# Altium project Itampos_Matuoklis.PrjPcb
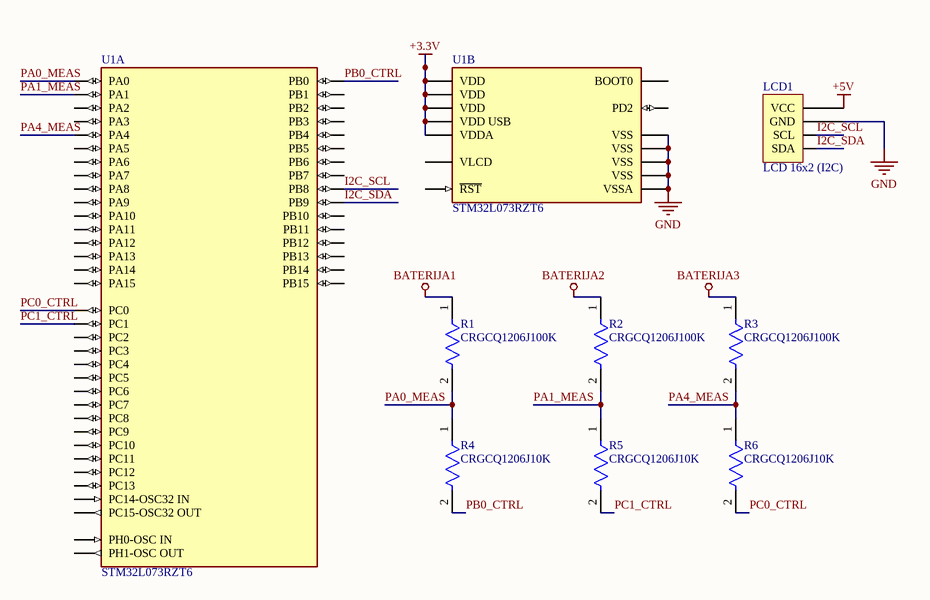
[diagram p0: schema.SchDoc]
1 sheet, 8 parts. Net scope: global (net labels, ports and power ports of the same name join across sheets).

## Sheet schema.SchDoc
size A; SheetNumber: 1; SheetTotal: 1

### Parts
LCD1  LCD 16x2 (I2C)
R1  CRGCQ1206J100K  [FP-CRGCQ1206-IPC_C]
R2  CRGCQ1206J100K  [FP-CRGCQ1206-IPC_C]
R3  CRGCQ1206J100K  [FP-CRGCQ1206-IPC_C]
R4  CRGCQ1206J10K  [FP-CRGCQ1206-IPC_C]
R5  CRGCQ1206J10K  [FP-CRGCQ1206-IPC_C]
R6  CRGCQ1206J10K  [FP-CRGCQ1206-IPC_C]
U1  STM32L073RZT6  [FP-LQFP64-5W-MFG]  (parts A,B of 2)

### Nets
+3.3V: U1.13(VDDA) U1.19(VDD) U1.32(VDD) U1.48(VDD_USB) U1.64(VDD)
+5V: LCD1.1(VCC)
BATERIJA1: R1.1
BATERIJA2: R2.1
BATERIJA3: R3.1
GND: LCD1.2(GND) U1.12(VSSA) U1.18(VSS) U1.31(VSS) U1.47(VSS) U1.63(VSS)
I2C_SCL: LCD1.3(SCL) U1.61(PB8)
I2C_SDA: LCD1.4(SDA) U1.62(PB9)
PA0_MEAS: R1.2 R4.1 U1.14(PA0)
PA1_MEAS: R2.2 R5.1 U1.15(PA1)
PA4_MEAS: R3.2 R6.1 U1.20(PA4)
PB0_CTRL: R4.2 U1.26(PB0)
PC0_CTRL: R6.2 U1.8(PC0)
PC1_CTRL: R5.2 U1.9(PC1)

Not connected (* = marked no-connect by the designer): U1 1(VLCD) 2(PC13) 3(PC14-OSC32_IN) 4(PC15-OSC32_OUT) 5(PH0-OSC_IN) 6(PH1-OSC_OUT) 7(~{RST}) 10(PC2) 11(PC3) 16(PA2) 17(PA3) 21(PA5) 22(PA6) 23(PA7) 24(PC4) 25(PC5) 27(PB1) 28(PB2) 29(PB10) 30(PB11) 33(PB12) 34(PB13) 35(PB14) 36(PB15) 37(PC6) 38(PC7) 39(PC8) 40(PC9) 41(PA8) 42(PA9) 43(PA10) 44(PA11) 45(PA12) 46(PA13) 49(PA14) 50(PA15) 51(PC10) 52(PC11) 53(PC12) 54(PD2) 55(PB3) 56(PB4) 57(PB5) 58(PB6) 59(PB7) 60(BOOT0)

### Library data of the parts
LCD1 = LCD_I2C
R1-R3 = CMP-03211-009069-1: CRGCQ1206 100KΩ 0.25W 5% ±100ppm/°C 200V; Manufacturer: TE Connectivity; Tolerance: 0.05; Manufacturer Part Number: CRGCQ1206J100K; Temperature Range High: +155°C; Temperature Range Low: -55°C; Temperature: -55°C to +155°C; Octopart: https://octopart.com/crgcq1206j100k-te+connectivity-91018303; ComponentLink2URL: https://www.te.com/commerce/DocumentDelivery/DDEController?Action=showdoc&DocId=Data+Sheet%7F1773204-3%7F1%7Fpdf%7FEnglish%7FENG_DS_1773204-3_1.pdf%7F4-2176347-1151; Resistance: 100KΩ; Value: 100KΩ; Category: Res; Power Rating: 0.25W; Ambient Temperature Range High: +70°C; ComponentLink2Description: Datasheet; Height: 0.65mm; Automotive Grade: Grade 1142; Automotive: Yes; Lead Free: Yes; Ipc Land Pattern Name: RESC310155X55; Device Class L1: Passive Components; RoHS: TRUE; Package: CRGCQ1206; Temperature Coefficient: ±100ppm/°C; Device Class L3: Chip SMD Resistors; Voltage Rating: 200V; Composition: Thick Film; Device Class L2: Resistors; Series: CRGCQ
R4-R6 = CMP-03211-002305-1: CRGCQ1206 10KΩ 0.25W 5% ±100ppm/°C 200V; Manufacturer: TE Connectivity; Automotive Grade: Grade 914; Tolerance: 0.05; Package: CRGCQ1206; Composition: Thick Film; Lead Free: Yes; Device Class L1: Passive Components; RoHS: TRUE; Temperature: -55°C to +155°C; Series: CRGCQ; Temperature Range Low: -55°C; Ipc Land Pattern Name: RESC310155X55; Value: 10KΩ; Resistance: 10KΩ; Manufacturer Part Number: CRGCQ1206J10K; Voltage Rating: 200V; Temperature Range High: +155°C; Temperature Coefficient: ±100ppm/°C; Device Class L3: Chip SMD Resistors; ComponentLink2Description: Datasheet; ComponentLink2URL: https://www.te.com/commerce/DocumentDelivery/DDEController?Action=showdoc&DocId=Data+Sheet%7F1773204-3%7F1%7Fpdf%7FEnglish%7FENG_DS_1773204-3_1.pdf%7F4-2176347-923; Device Class L2: Resistors; Ambient Temperature Range High: +70°C; Automotive: Yes; Octopart: https://octopart.com/crgcq1206j10k-te+connectivity-91018305; Category: Res; Height: 0.65mm; Power Rating: 0.25W
U1 = CMP-12105-000144-1: IC MCU 32BIT 192KB FLASH 64LQFP; Core Architecture: ARM; Interface: I2C; Oscillator Type: Internal; Min Supply Voltage: 1.65V; Frequency: 32MHz; Number of I/Os: 51; RAM Size: 20KB; Peripherals: Brown-out Detect/Reset; Max Supply Voltage: 3.6V; Max Operating Temperature: 85°C; Case/Package: LQFP; RoHS Compliant: Yes; Number of Pins: 64; Min Operating Temperature: -40°C; Memory Type: FLASH; Packaging: Tray; Memory Size: 192KB; REACH SVHC: No SVHC